# EAGLE design IOMOD-v1_0 (EAGLE 9.7.0)
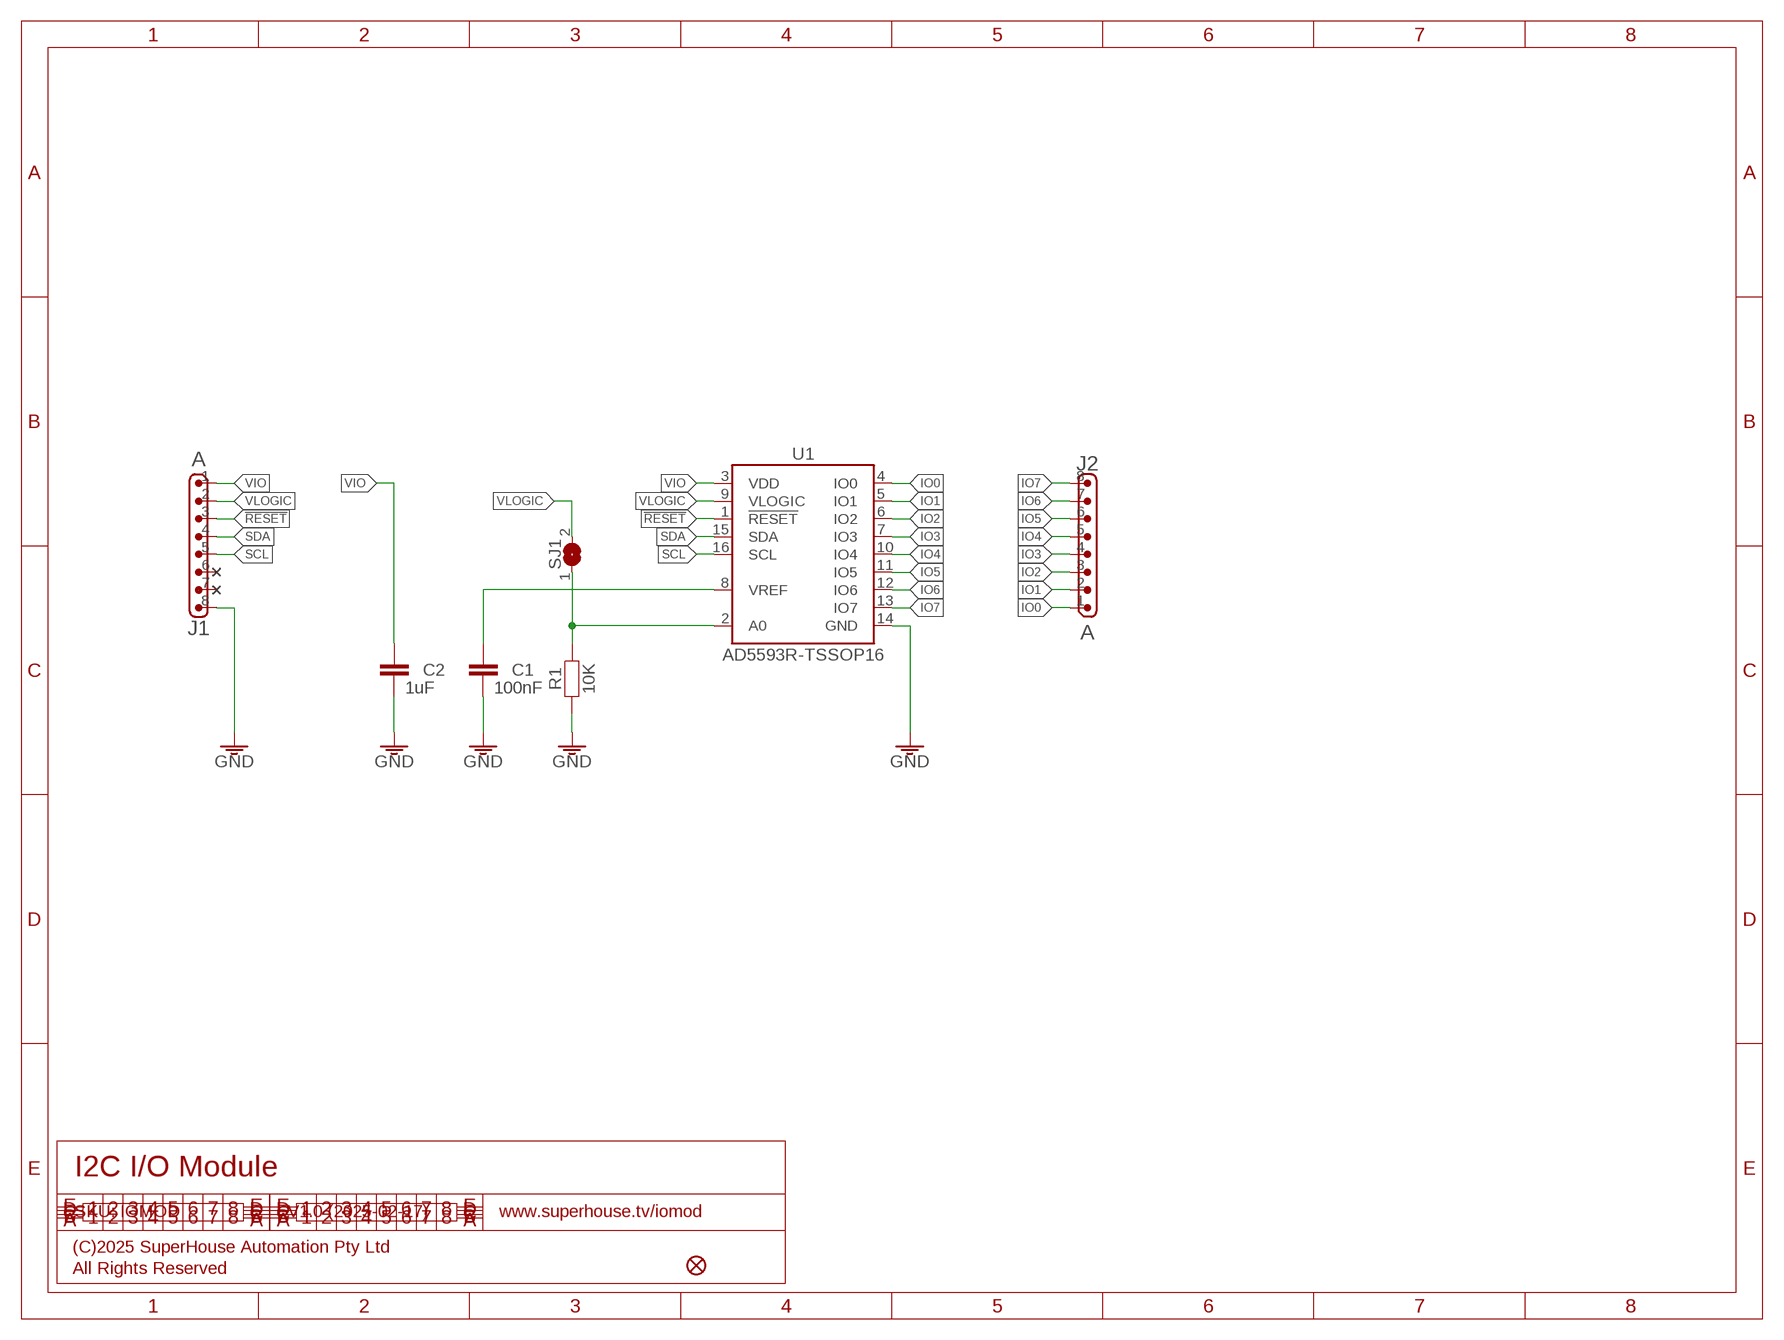
[diagram p0: schematic, sheet 1]

## Parts
C1  100nF  CAP0603  [C0603]
C2  1uF  CAP0603  [C0603]
FID1  FIDUCIAL1X2.5  [FIDUCIAL-1X2.5]
J1  A  M08-2.00-P-BELOW  [1X8-2.00-P-BELOW]
J2  A  M08-2.00-P-BELOW  [1X8-2.00-P-BELOW]
R1  10K  RESISTOR0603  [R0603]
SJ1  SJ-NORMAL  [SJ]
U1  AD5593R-TSSOP16  [TSSOP16]

## Nets
!RESET: J1.3 U1.1(!RESET)
GND: C1.2 C2.2 J1.8 R1.1 U1.14(GND)
IO0: J2.1 U1.4(IO0)
IO1: J2.2 U1.5(IO1)
IO2: J2.3 U1.6(IO2)
IO3: J2.4 U1.7(IO3)
IO4: J2.5 U1.10(IO4)
IO5: J2.6 U1.11(IO5)
IO6: J2.7 U1.12(IO6)
IO7: J2.8 U1.13(IO7)
N$1: R1.2 SJ1.1 U1.2(A0)
N$3: C1.1 U1.8(VREF)
SCL: J1.5 U1.16(SCL)
SDA: J1.4 U1.15(SDA)
VIO: C2.1 J1.1 U1.3(VDD)
VLOGIC: J1.2 SJ1.2 U1.9(VLOGIC)
Unconnected: J1.6 J1.7

## Notes on the sheet
- I2C I/O Module
- SKU: IOMOD | V1.0 (2025-02-17) | www.superhouse.tv/iomod
- (C)2025 SuperHouse Automation Pty Ltd
- All Rights Reserved

## Library data of the parts
C1 C2 = SuperHouse-Capacitors:CAP: Capacitor Standard ceramic capacitor
FID1 = SuperHouse-Symbols:FIDUCIAL: Fiducial Alignment Points Various fiducial points for machine vision alignment.
J1 J2 = SuperHouse-Connectors:M08: 8-way header Standard 1x8 header, and screw terminal variations
R1 = SuperHouse-Resistors:RESISTOR: Resistors in both surface-mount and through-hole versions.
SJ1 = SuperHouse-Jumpers:SJ: SMD solder jumper, normally-open. Add solder to close the connection.
U1 = SuperHouse-ICs:AD5593R

## Net classes
0 Default: width 0.203 mm
1 VCC: width 0.305 mm

## Board
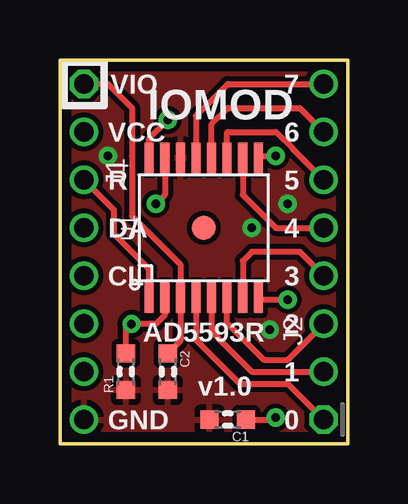
[diagram p1: board, top side]
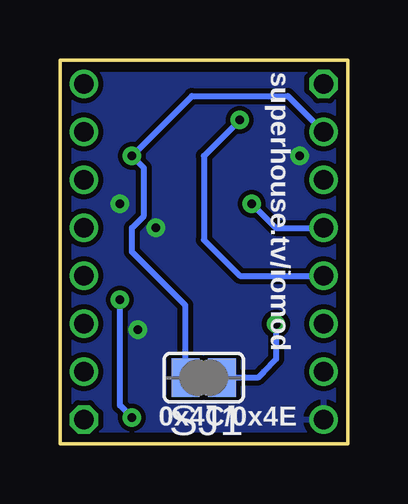
[diagram p2: board, bottom side, seen from below]

Size 12 x 16 mm. Coordinates in mm from the lower left corner, seen from the top.
Outline: 12,0 0,0 0,16 12,16 12,0
Copper layers (1*16): Top 0.035mm / dielectric 1.5mm / Bottom 0.035mm
Design rules "SuperHouse-Design-Rules *": minimum track width 10mil, minimum drill 24mil, track to track 8mil, track to pad 8mil, pad to pad 8mil, via to via 8mil, smd to smd 6mil, copper to edge 0.4mm, drill to drill 8mil, minimum pad ring 7mil, minimum via ring 8mil, stop-mask expansion 4mil, vias tented up to drill 0.5mm, thermal gap 10mil

### Footprints (pad centres in the part's own frame; a part is rotated, then mirrored left to right if it is on the bottom)
C0603 = smd 0.762 x 0.762: 1 -0.762,0; 2 0.762,0
FIDUCIAL-1X2.5 = smd 1 x 1: 1 0,0
1X8-2.00-P-BELOW = drill 0.8 octagon: 1 -7,0 | drill 0.8: 2 -5,0; 3 -3,0; 4 -1,0; 5 1,0; 6 3,0; 7 5,0; 8 7,0
R0603 = smd 0.762 x 0.762: 1 -0.762,0; 2 0.762,0
SJ = smd 1.168 x 1.6: 1 -0.762,0; 2 0.762,0
TSSOP16 = smd 1.27 x 0.381: 1 -2.925,2.275; 2 -2.925,1.625; 3 -2.925,0.975; 4 -2.925,0.325; 5 -2.925,-0.325; 6 -2.925,-0.975; 7 -2.925,-1.625; 8 -2.925,-2.275; 9 2.925,-2.275; 10 2.925,-1.625; 11 2.925,-0.975; 12 2.925,-0.325; 13 2.925,0.325; 14 2.925,0.975; 15 2.925,1.625; 16 2.925,2.275

### Placement (x,y rotation side)
C1  7,1 180 top
C2  4.5,3 270 top
FID1  6,9 0 top
J1  1,8 270 top
J2  11,8 90 top
R1  2.75,3 90 top
SJ1  6,2.75 180 bottom
U1  6,9 90 top

### Tracks (layer width: path | path; a pad name or v marks a point on that pad's centre or on a via)
!RESET
  Top 0.254: U1.1 3.73,7.28 3,8 2.25,8.75 2.25,9.75 J1.3
GND  (via drill 0.35)
  other vias: 8,9 9.5,10 8.75,4.75 2,12
  pour Top: 0.04,0.04 11.96,0.04 11.96,15.96 0.04,15.96
  pour Bottom: 0.04,0.04 11.96,0.04 11.96,15.96 0.04,15.96
IO0
  Top 0.254: U1.4 5.67,4.33 7,3 7.5,2.5 9.5,2.5 J2.1
IO1
  Top 0.254: U1.5 6.33,4.67 8,3 J2.2
IO2
  Top 0.254: U1.6 6.97,5.03 8.5,3.5 9.5,3.5 J2.3
IO3
  Top 0.254: J2.4 10,8 9,8 8,8 7.62,7.62 U1.7
IO4
  Top 0.254: U1.10 7.62,10.38 8,10 9,9 J2.5
IO5
  Top 0.254: U1.11 6.97,12.97 7,13 9,13 9.71,12.29 J2.6
IO6
  Top 0.254: U1.12 6.33,13.32 7,14 10,14 J2.7
IO7
  Top 0.254: U1.13 5.67,13.68 6,14 7,15 J2.8
N$1  (via drill 0.35)
  Top 0.254: U1.2 4.38,5.38 4,5 3,5 v2.98,4.98 2.75,4.75 R1.2
  Bottom 0.254: v2.98,4.98 2.98,3.52 3.5,3 3.75,2.75 SJ1.1
N$3  (via drill 0.35)
  Top 0.254: C1.1 9,1 v9,1.08 | v9.5,6 8.35,6 U1.8
  Bottom 0.254: v9,1.08 9.5,1.58 v9.5,6
SCL  (via drill 0.35)
  Top 0.254: U1.16 3.73,12.72 v4.5,13.5
  Bottom 0.254: v4.5,13.5 6,12 6,8.5 4.5,7 J1.5
SDA  (via drill 0.35)
  Top 0.254: U1.15 4.38,10.38 v4,10
  Bottom 0.254: v4,10 3,9 J1.4
VIO
  Top 0.254: J1.1 2,15 3,14 3,12 3,9.5 4,8.5 5.03,7.47 U1.3 5.03,4.29 C2.1
VLOGIC  (via drill 0.35)
  Top 0.254: U1.9 8.35,12 v9,12
  Bottom 0.254: J1.2 2.5,14.5 6.5,14.5 v9,12 8.5,11.5 8.5,9.5 9,9 9,8.5 9,8 8.5,7.5 6.76,5.76 SJ1.2

### Text on the board
tPlace: VIO | 7 | IOMOD | VCC | 6 | !R | 5 | DA | 4 | CL | 3 | 2 | AD5593R | 1 | v1.0 | GND | 0
bPlace: superhouse.tv/iomod | 0x4C/0x4E